# EAGLE design futurew (EAGLE 9.4.2)
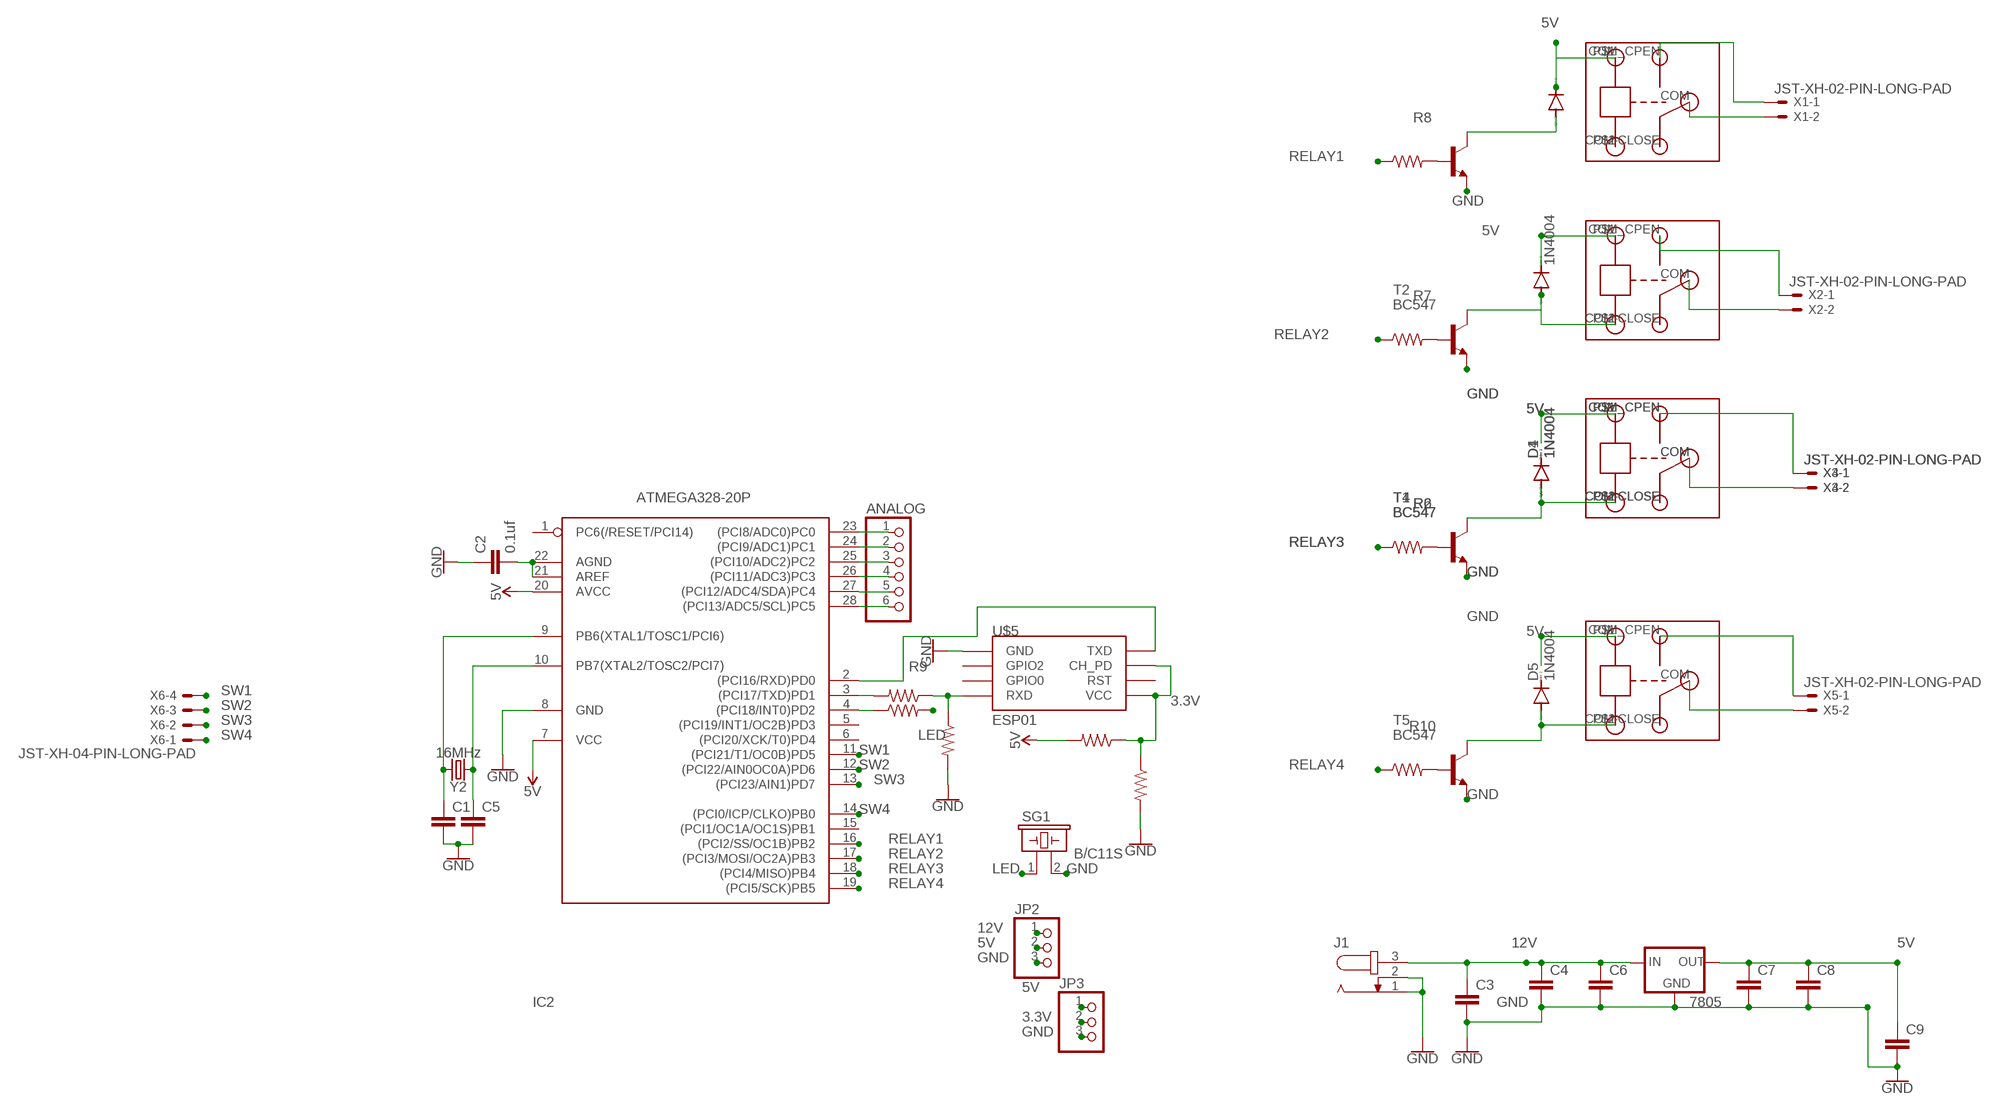
[diagram p0: schematic, sheet 1]

## Parts
7805  78XXL  [78XXL]
ANALOG  PINHD-1X6  [1X06]
C1  C2,5-3  [C2.5-3]
C2  0.1uf  C2,5-3  [C2.5-3]
C3  C2,5-3  [C2.5-3]
C4  C2,5-3  [C2.5-3]
C5  C2,5-3  [C2.5-3]
C6  C2,5-3  [C2.5-3]
C7  C2,5-3  [C2.5-3]
C8  C2,5-3  [C2.5-3]
C9  C2,5-3  [C2.5-3]
D1  1N4004  [DO41-10]
D2  1N4004  [DO41-10]
D3  1N4004  [DO41-10]
D4  1N4004  [DO41-10]
D5  1N4004  [DO41-10]
IC2  ATMEGA328-20P  [DIL28-3]
J1  JACK-PLUG1  [SPC4078]
JP2  PINHD-1X3  [1X03]
JP3  PINHD-1X3  [1X03]
R1  1k  10MOHM-HORIZ-1/4W-5%  [AXIAL-0.3]
R2  1k  10MOHM-HORIZ-1/4W-5%  [AXIAL-0.3]
R3  2k  10MOHM-HORIZ-1/4W-5%  [AXIAL-0.3]
R4  1k  10MOHM-HORIZ-1/4W-5%  [AXIAL-0.3]
R5  2k  10MOHM-HORIZ-1/4W-5%  [AXIAL-0.3]
R6  10M  10MOHM-HORIZ-1/4W-5%  [AXIAL-0.3]
R7  1k  10MOHM-HORIZ-1/4W-5%  [AXIAL-0.3]
R8  1k  10MOHM-HORIZ-1/4W-5%  [AXIAL-0.3]
R9  1k  10MOHM-HORIZ-1/4W-5%  [AXIAL-0.3]
R10  1k  10MOHM-HORIZ-1/4W-5%  [AXIAL-0.3]
SG1  B/C11S  [B/C11S]
T1  BC547  [TO92]
T2  BC547  [TO92]
T3  BC547  [TO92]
T4  BC547  [TO92]
T5  BC547  [TO92]
U$1  RELAY  [RELAY]
U$2  RELAY  [RELAY]
U$3  RELAY  [RELAY]
U$4  RELAY  [RELAY]
U$5  ESP01  [ESP01]
U$6  RELAY  [RELAY]
X1  JST-XH-02-PIN-LONG-PAD  [JST-XH-02-PACKAGE-LONG-PAD]
X2  JST-XH-02-PIN-LONG-PAD  [JST-XH-02-PACKAGE-LONG-PAD]
X3  JST-XH-02-PIN-LONG-PAD  [JST-XH-02-PACKAGE-LONG-PAD]
X4  JST-XH-02-PIN-LONG-PAD  [JST-XH-02-PACKAGE-LONG-PAD]
X5  JST-XH-02-PIN-LONG-PAD  [JST-XH-02-PACKAGE-LONG-PAD]
X6  JST-XH-04-PIN-LONG-PAD  [JST-XH-04-PACKAGE-LONG-PAD]
Y2  16MHz  CRYSTAL-16MHZPTH-HC49US  [HC49US]

## Nets
3.3V: JP3.2 R4.P$1 R5.P$1 U$5.CH_PD U$5.VCC
5V: 7805.OUT C7.1 C8.1 C9.1 D2.C D3.C IC2.7(VCC) IC2.20(AVCC) JP2.2 JP3.1 R4.P$2 U$1.P$1(IN) U$2.P$1(IN) U$3.P$1(IN) U$4.P$1(IN) U$6.P$1(IN)
12V: 7805.IN C3.1 C4.1 C6.1 J1.3 JP2.1
GND: 7805.GND C1.2 C2.1 C3.2 C4.2 C5.2 C6.2 C7.2 C8.2 C9.2 IC2.8(GND) J1.1 J1.2 JP2.3 JP3.3 R3.P$2 R5.P$2 SG1.2 T1.1(E) T2.1(E) T3.1(E) T4.1(E) T5.1(E) U$5.GND
LED: R9.P$2 SG1.1
N$1: R1.P$1 R3.P$1 U$5.RX(RXD)
N$2: IC2.3((PCI17/TXD)PD1) R1.P$2
N$3: IC2.2((PCI16/RXD)PD0) U$5.TX(TXD)
N$8: ANALOG.1 IC2.23((PCI8/ADC0)PC0)
N$9: ANALOG.2 IC2.24((PCI9/ADC1)PC1)
N$10: ANALOG.3 IC2.25((PCI10/ADC2)PC2)
N$11: C2.2 IC2.21(AREF) IC2.22(AGND)
N$12: ANALOG.4 IC2.26((PCI11/ADC3)PC3)
N$13: ANALOG.5 IC2.27((PCI12/ADC4/SDA)PC4)
N$14: ANALOG.6 IC2.28((PCI13/ADC5/SCL)PC5)
N$17: D1.A T1.3(C) U$1.P$2(GND)
N$18: U$3.COM_CPEN(COM-OPEN) X1.1
N$19: D2.A T2.3(C) U$2.P$2(GND)
N$20: D3.A T3.3(C)
N$21: U$3.COM X1.2
N$22: U$2.COM X2.2
N$23: R6.P$2 T1.2(B)
N$24: R7.P$2 T2.2(B)
N$25: R8.P$2 T3.2(B)
N$26: IC2.4((PCI18/INT0)PD2) R9.P$1
N$30: U$2.COM_CPEN(COM-OPEN) X2.1
N$31: U$1.COM X3.2
N$32: U$1.COM_CPEN(COM-OPEN) X3.1
N$33: D4.A T4.3(C) U$4.P$2(GND)
N$34: R2.P$2 T4.2(B)
N$35: U$4.COM X4.2
N$36: U$4.COM_CPEN(COM-OPEN) X4.1
N$37: U$1.COM-CLOSE U$4.COM-CLOSE
N$38: D1.C D4.C
N$39: D5.A T5.3(C) U$6.P$2(GND)
N$40: R10.P$2 T5.2(B)
N$41: U$6.COM X5.2
N$42: U$6.COM_CPEN(COM-OPEN) X5.1
N$43: C5.1 IC2.10(PB7(XTAL2/TOSC2/PCI7)) Y2.1
N$45: C1.1 IC2.9(PB6(XTAL1/TOSC1/PCI6)) Y2.2
RELAY1: IC2.16((PCI2/SS/OC1B)PB2) R8.P$1
RELAY2: IC2.17((PCI3/MOSI/OC2A)PB3) R7.P$1
RELAY3: IC2.18((PCI4/MISO)PB4) R2.P$1 R6.P$1
RELAY4: IC2.19((PCI5/SCK)PB5) R10.P$1
SW1: IC2.11((PCI21/T1/OC0B)PD5) X6.4
SW2: IC2.12((PCI22/AIN0OC0A)PD6) X6.3
SW3: IC2.13((PCI23/AIN1)PD7) X6.2
SW4: IC2.14((PCI0/ICP/CLKO)PB0) X6.1
Unconnected: D5.C IC2.1(PC6(/RESET/PCI14)) IC2.5((PCI19/INT1/OC2B)PD3) IC2.6((PCI20/XCK/T0)PD4) IC2.15((PCI1/OC1A/OC1S)PB1) U$2.COM-CLOSE U$3.COM-CLOSE U$3.P$2(GND) U$5.GPIO0 U$5.GPIO2 U$5.RST U$6.COM-CLOSE

## Library data of the parts
7805 = v-reg:78XXL: VOLTAGE REGULATOR
ANALOG = pinhead:PINHD-1X6: PIN HEADER
C1-C9 = capacitor-wima:C: CAPACITOR naming: grid - package width
D1-D5 = diode:1N4004: DIODE general purpose rectifier, 1 A
IC2 = atmega328:ATMEGA328*P: MICROCONTROLLER 32 kBytes FLASH 2 kBytes SRAM 1 kBytes EEPROM USART 8-channel 10 bit ADC
J1 = con-jack:JACK-PLUG: DC POWER JACK Power Jack, DC, Right Angle, Through Hole, Rated 5A at 16VDC, PC Terminals Distributor: Farnell (www.Farnell.de) Drawing: 84N1161.pdf / 84N1162.pdf Manufacturer: SPC Technology (www.spctechnology.com) Type: SPC4077 / SPC 4078; OC_FARNELL: unknown; OC_NEWARK: unknown
JP2 JP3 = pinhead:PINHD-1X3: PIN HEADER
R1-R5 R7-R10 = SparkFun-Resistors:10MOHM: RES-09327; PROD_ID: RES-09327; VALUE: 10M
R6 = SparkFun-Resistors:10MOHM: RES-09327; PROD_ID: RES-09327
SG1 = buzzer:B/C11S: BUZZER Source: Buerklin; OC_FARNELL: unknown; OC_NEWARK: unknown
T1-T5 = transistor:BC547: NPN TRANSISTOR
U$1-U$4 U$6 = RELAY:RELAY
U$5 = esp8266modules:ESP01: ESP8266 Wifi module 01
X1-X5 = Rembrandt Electronics - JST XH Connectors v1-0:JST-XH-02-PIN: JST XH Connector 2 Pin Wire to board connector. Pitch: 2,54 mm, (0.100") Number of pins: 2 Created by Rembrandt Electronics www.rembrandtelectronics.com
X6 = Rembrandt Electronics - JST XH Connectors v1-0:JST-XH-04-PIN: JST XH Connector 2 Pin Wire to board connector. Pitch: 2,54 mm, (0.100") Number of pins: 4 Created by Rembrandt Electronics www.rembrandtelectronics.com
Y2 = SparkFun-Clocks:CRYSTAL-16MHZ: 16MHz Crystal Digikey Example <http://www.digikey.com/product-search/en?keywords=535-9122-1-ND> Frequency: 16MHz Frequency Stability: ±50ppm Frequency Tolerance: ±20ppm Load Capacitance: 18pF SparkFun Products: Pro Micro -5V/16MHz <https://www.sparkfun.com/products/12640> SparkFun Serial Enabled LCD Kit <https://www.sparkfun.com/products/10097>; PROD_ID: XTAL-08181; SF_ID: COM-00536

## Net classes
0 default: width 1.016 mm, clearance 0.381 mm

## Board
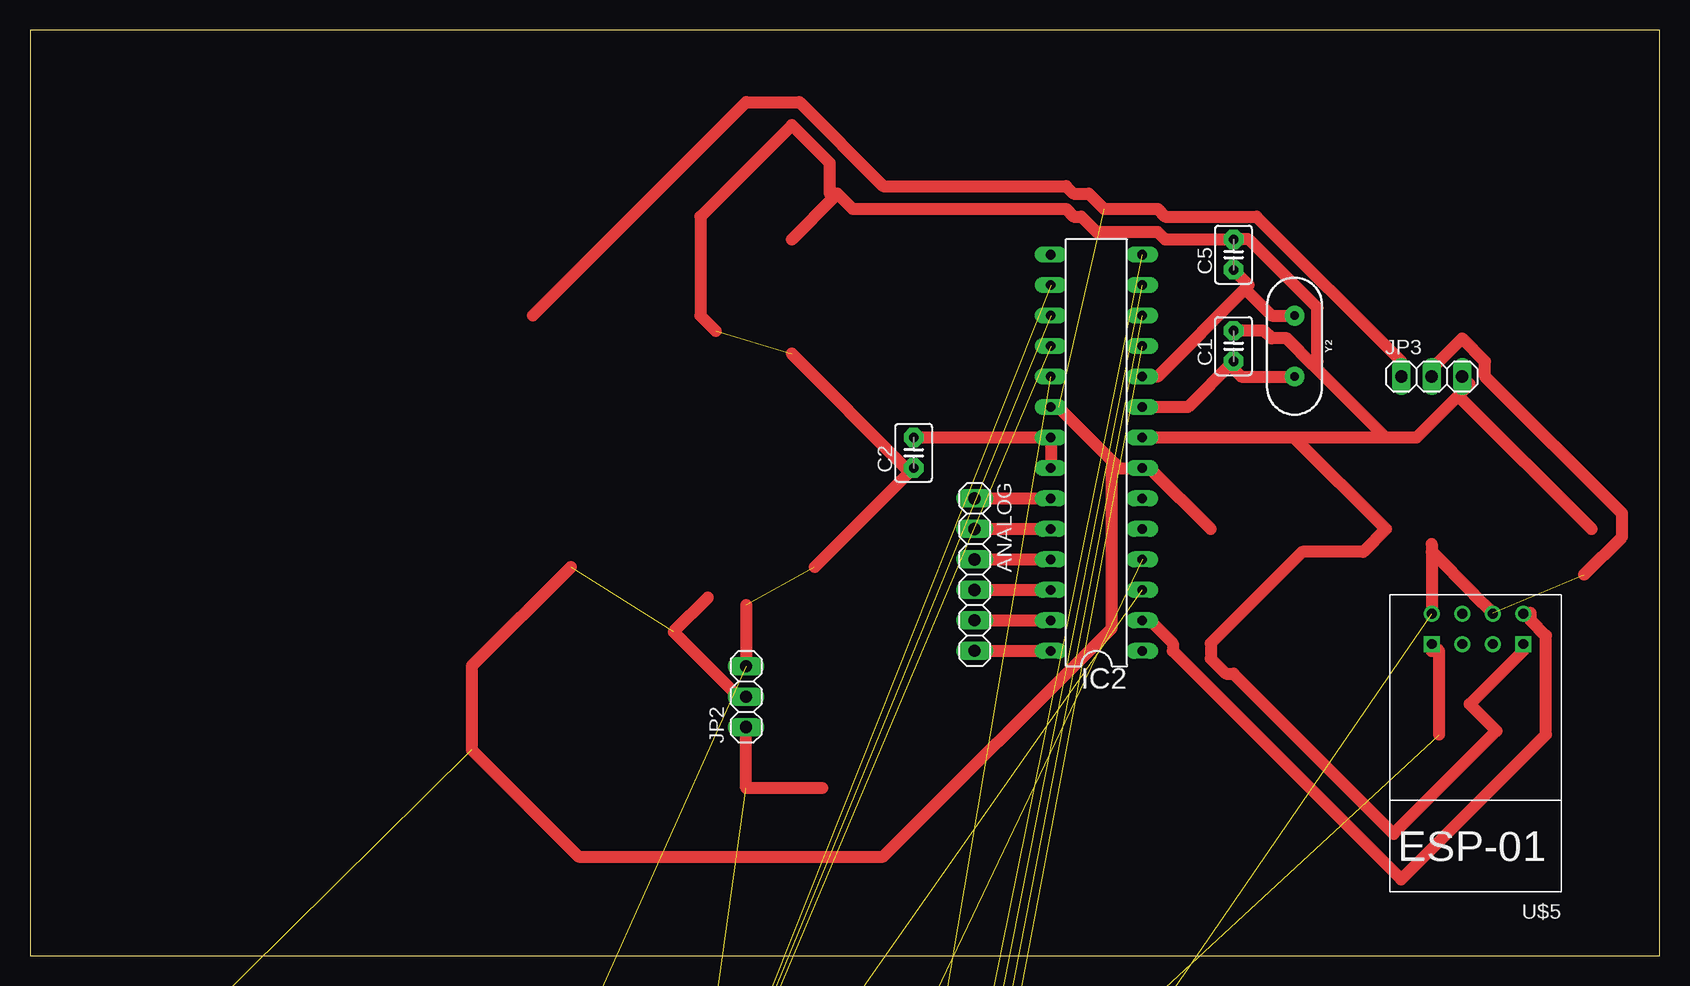
[diagram p1: board, top side]

Size 135.87 x 77.14 mm. Coordinates in mm from the lower left corner, seen from the top.
Outline: 0,0 135.87,0 135.87,77.14 0,77.14 0,0
Copper layers (1*16): Top 0.035mm / dielectric 1.5mm / Bottom 0.035mm
Design rules "default": minimum track width 6mil, minimum drill 0.35mm, track to track 6mil, track to pad 6mil, pad to pad 6mil, via to via 6mil, smd to smd 6mil, copper to edge 40mil, drill to drill 6mil, minimum pad ring 10mil, minimum via ring 8mil, stop-mask expansion 4mil, vias tented up to drill 0mil, thermal gap 10mil

### Footprints (pad centres in the part's own frame; a part is rotated, then mirrored left to right if it is on the bottom)
78XXL = drill 1.016 long: GND 0,-3.81; IN -2.54,-3.81; OUT 2.54,-3.81 | hole 3.302: 0,11.176
1X06 = drill 1.016 long: 1 -6.35,0; 2 -3.81,0; 3 -1.27,0; 4 1.27,0; 5 3.81,0; 6 6.35,0
C2.5-3 = drill 0.813 pad 1.6 octagon: 1 -1.27,0; 2 1.27,0
DO41-10 = drill 1.118: A 5.08,0; C -5.08,0
DIL28-3 = drill 0.813 long: 1 -16.51,-3.81; 2 -13.97,-3.81; 3 -11.43,-3.81; 4 -8.89,-3.81; 5 -6.35,-3.81; 6 -3.81,-3.81; 7 -1.27,-3.81; 8 1.27,-3.81; 9 3.81,-3.81; 10 6.35,-3.81; 11 8.89,-3.81; 12 11.43,-3.81; 13 13.97,-3.81; 14 16.51,-3.81; 15 16.51,3.81; 16 13.97,3.81; 17 11.43,3.81; 18 8.89,3.81; 19 6.35,3.81; 20 3.81,3.81; 21 1.27,3.81; 22 -1.27,3.81; 23 -3.81,3.81; 24 -6.35,3.81; 25 -8.89,3.81; 26 -11.43,3.81; 27 -13.97,3.81; 28 -16.51,3.81
SPC4078 = drill 0.8 pad 2.184 long: 1 -3,0; 2 0,-4.8 | drill 1 pad 2.184 long: 3 3,0
1X03 = drill 1.016 long: 1 -2.54,0; 2 0,0; 3 2.54,0
AXIAL-0.3 = drill 0.9 pad 1.88: P$1 -3.81,0; P$2 3.81,0
B/C11S = drill 1.321 pad 2.54 octagon: 1 -3.759,0; 2 3.759,0
TO92 = drill 0.813 octagon: 1 1.27,0; 2 0,1.905; 3 -1.27,0
RELAY = drill 1.1 octagon: COM -2,0; COM-CLOSE 12.2,-6; COM_CPEN 12.2,6; P$1 0,6; P$2 0,-6
ESP01 = drill 0.8: CH_PD -1.285,-8.178; GPIO0 1.255,-5.638; GPIO2 -1.285,-5.638; RST 1.255,-8.178; TX -3.825,-8.178; VCC 3.795,-8.178 | drill 0.8 square: GND -3.825,-5.638; RX 3.795,-5.638
JST-XH-02-PACKAGE-LONG-PAD = drill 1.016 long: 1 -1.27,0; 2 1.27,0
JST-XH-04-PACKAGE-LONG-PAD = drill 1.016 long: 1 -3.81,0; 2 -1.27,0; 3 1.27,0; 4 3.81,0
HC49US = drill 0.7 pad 1.651: 1 -2.54,0; 2 2.54,0

### Placement (x,y rotation side)
7805  17.78,-300.99 0 top  (outside the outline)
ANALOG  78.74,31.75 270 top
C1  100.33,50.8 90 top
C2  73.66,41.91 90 top
C3  19.05,-311.15 0 top  (outside the outline)
C4  24.13,-311.15 0 top  (outside the outline)
C5  100.33,58.42 90 top
C6  2.54,-323.85 0 top  (outside the outline)
C7  7.62,-323.85 0 top  (outside the outline)
C8  12.7,-323.85 0 top  (outside the outline)
C9  17.78,-323.85 0 top  (outside the outline)
D1  6.35,-114.3 0 top  (outside the outline)
D2  6.35,-121.92 0 top  (outside the outline)
D3  6.35,-129.54 0 top  (outside the outline)
D4  27.94,-232.41 0 top  (outside the outline)
D5  27.94,-359.41 0 top  (outside the outline)
IC2  88.9,41.91 90 top
J1  11.43,-313.69 0 top  (outside the outline)
JP2  59.69,21.59 90 top
JP3  116.84,48.26 0 top
R1  5.08,-88.9 0 top  (outside the outline)
R2  19.05,-238.76 0 top  (outside the outline)
R3  5.08,-135.89 0 top  (outside the outline)
R4  5.08,-139.7 0 top  (outside the outline)
R5  5.08,-143.51 0 top  (outside the outline)
R6  5.08,-147.32 0 top  (outside the outline)
R7  5.08,-151.13 0 top  (outside the outline)
R8  5.08,-154.94 0 top  (outside the outline)
R9  5.08,-158.75 0 top  (outside the outline)
R10  19.05,-365.76 0 top  (outside the outline)
SG1  35.56,-161.29 0 top  (outside the outline)
T1  3.81,-97.79 0 top  (outside the outline)
T2  3.81,-102.87 0 top  (outside the outline)
T3  3.81,-107.95 0 top  (outside the outline)
T4  3.81,-240.03 0 top  (outside the outline)
T5  3.81,-367.03 0 top  (outside the outline)
U$1  13.97,-11.43 0 top  (outside the outline)
U$2  13.97,-40.64 0 top  (outside the outline)
U$3  13.97,-69.85 0 top  (outside the outline)
U$4  13.97,-210.82 0 top  (outside the outline)
U$5  120.65,20.32 180 top
U$6  13.97,-337.82 0 top  (outside the outline)
X1  6.35,-179.07 0 top  (outside the outline)
X2  6.35,-187.96 0 top  (outside the outline)
X3  6.35,-196.85 0 top  (outside the outline)
X4  6.35,-233.68 0 top  (outside the outline)
X5  6.35,-360.68 0 top  (outside the outline)
X6  8.89,-374.65 0 top  (outside the outline)
Y2  105.41,50.8 270 top

### Tracks (layer width: path | path; a pad name or v marks a point on that pad's centre or on a via)
3.3V  (3 unrouted)
  Top 1.016: 116.84,34.29 116.84,33.66 | 116.84,33.66 116.84,28.57 U$5.VCC | 116.84,33.66 120.33,30.16 121.92,28.57 U$5.CH_PD | JP3.2 116.84,48.9 119.38,51.44 121.28,49.53 121.28,48.26 132.72,36.83 132.72,34.92 129.54,31.75
5V  (14 unrouted)
  Top 1.016: 90.49,40.96 85.72,45.72 IC2.20 | 90.49,40.96 90.81,40.64 IC2.7 93.34,40.64 98.42,35.56 | 56.52,29.84 53.66,26.99 59.05,21.59 JP2.2 | JP3.1 114.3,49.53 102.23,61.59 94.61,61.59 93.98,62.23 89.53,62.23 88.27,63.5 87,63.5 86.36,64.14 71.12,64.14 64.14,71.12 59.69,71.12 41.91,53.34 | 45.09,32.38 36.83,24.13 36.83,17.14 45.72,8.26 71.12,8.26 90.17,27.3 90.17,40.64 90.49,40.96
12V  (5 unrouted)
  Top 1.016: 66.04,13.97 59.69,13.97 JP2.1
GND  (19 unrouted)
  Top 1.016: U$5.GND 124.46,25.4 120.02,20.95 122.24,18.73 113.67,10.16 100.33,23.5 99.69,23.5 98.42,24.77 98.42,26.04 106.05,33.66 111.12,33.66 113.03,35.56 105.41,43.18 | 113.03,43.18 115.57,43.18 119.06,46.67 | 113.03,43.18 105.41,43.18 | 105.41,43.18 IC2.8 | 119.06,46.67 120.02,47.62 JP3.3 | 119.06,46.67 130.18,35.56 | C1.2 102.87,52.07 103.5,51.44 104.78,51.44 107,49.21 | 113.03,43.18 107,49.21 | 107,49.21 107.31,49.53 107.31,53.98 101.6,59.69 C5.2 94.61,59.69 93.98,60.33 88.9,60.33 87.63,61.59 87,61.59 86.36,62.23 68.58,62.23 67.31,63.5 66.99,63.18 | 59.69,29.21 JP2.3 | 66.99,63.18 63.5,59.69 | 65.41,32.38 C2.1 73.03,40.64 63.5,50.16 | 57.15,52.07 55.88,53.34 55.88,61.59 63.5,69.22 66.67,66.04 66.67,63.5 66.99,63.18
LED  (1 unrouted)
N$1  (2 unrouted)
  Top 1.016: 117.47,18.41 117.47,25.4 U$5.RX 116.84,25.4
N$2  (1 unrouted)
N$3
  Top 1.016: IC2.2 93.34,27.94 95.25,26.04 95.25,25.4 114.3,6.35 126.36,18.41 126.36,26.67 125.09,27.94 125.09,28.57 U$5.TX
N$8
  Top 1.016: ANALOG.1 IC2.23
N$9
  Top 1.016: ANALOG.2 IC2.24
N$10
  Top 1.016: ANALOG.3 IC2.25
N$11
  Top 1.016: IC2.22 IC2.21 C2.2
N$12
  Top 1.016: ANALOG.4 IC2.26
N$13
  Top 1.016: ANALOG.5 IC2.27
N$14
  Top 1.016: ANALOG.6 IC2.28
N$17  (2 unrouted)
N$18  (1 unrouted)
N$19  (2 unrouted)
N$20  (1 unrouted)
N$21  (1 unrouted)
N$22  (1 unrouted)
N$23  (1 unrouted)
N$24  (1 unrouted)
N$25  (1 unrouted)
N$26  (1 unrouted)
N$30  (1 unrouted)
N$31  (1 unrouted)
N$32  (1 unrouted)
N$33  (2 unrouted)
N$34  (1 unrouted)
N$35  (1 unrouted)
N$36  (1 unrouted)
N$37  (1 unrouted)
N$38  (1 unrouted)
N$39  (2 unrouted)
N$40  (1 unrouted)
N$41  (1 unrouted)
N$42  (1 unrouted)
N$43
  Top 1.016: IC2.10 93.98,48.26 101.28,55.56 | 101.28,55.56 101.6,55.88 C5.1 | Y2.1 103.5,53.34 101.28,55.56
N$45
  Top 1.016: IC2.9 96.52,45.72 C1.1 100.33,48.9 100.97,48.26 Y2.2
RELAY1  (1 unrouted)
RELAY2  (1 unrouted)
RELAY3  (2 unrouted)
RELAY4  (1 unrouted)
SW1  (1 unrouted)
SW2  (1 unrouted)
SW3  (1 unrouted)
SW4  (1 unrouted)